# Altium schematic sheet 06-AD9546_TimestampInputs.SchDoc
size A; SheetNumber: 6; SheetTotal: 16
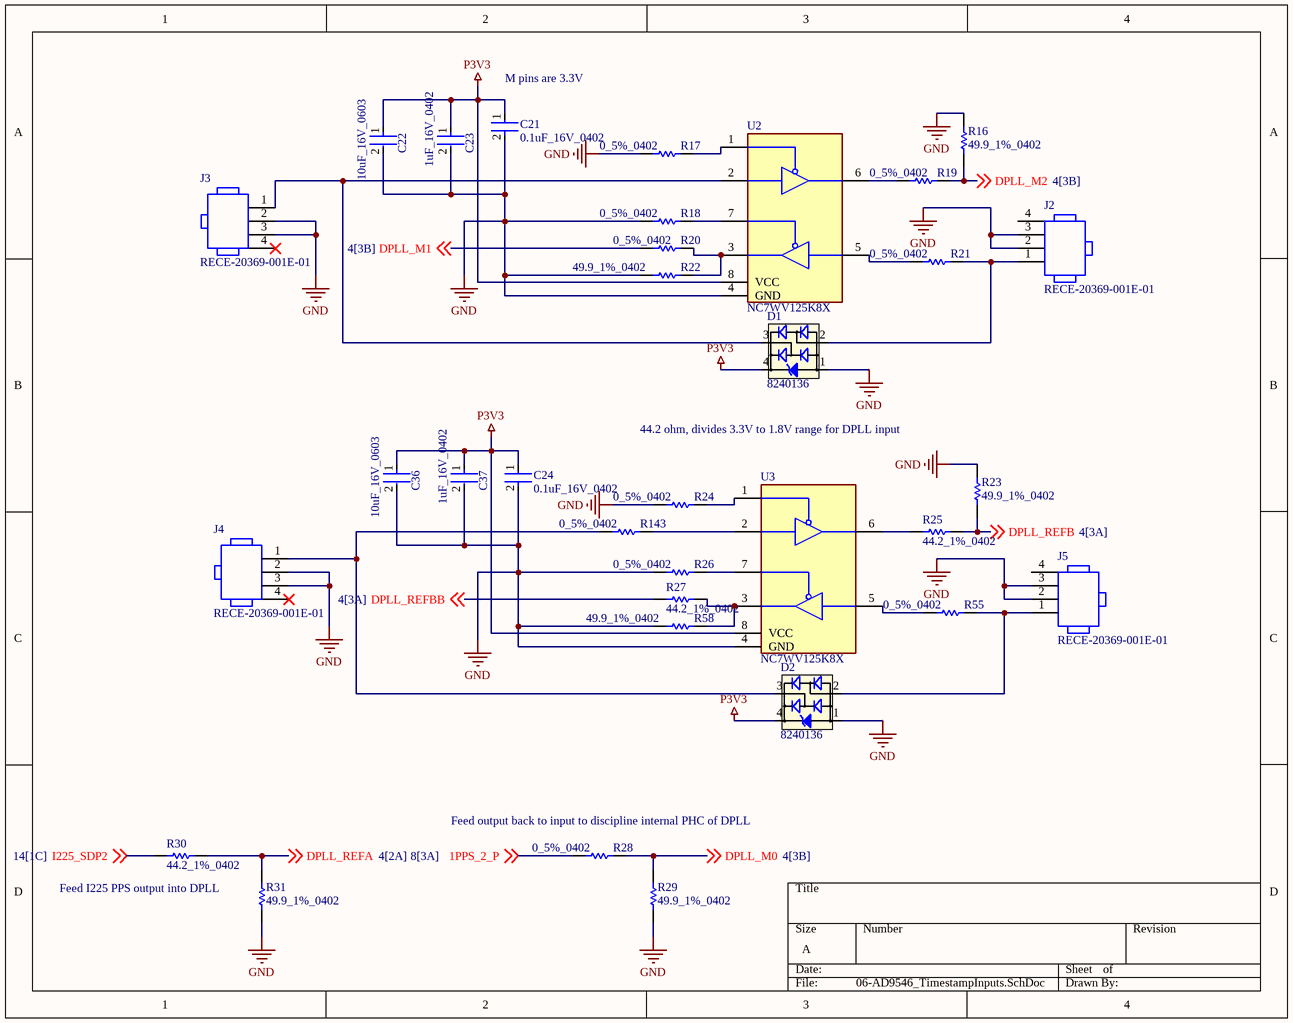
[diagram p0: 06-AD9546_TimestampInputs.SchDoc]

## Parts
C21  Digikey Description: 0.1uF_16V_0402  [FP-GRM15-MFG]  (hidden comment: GRM155R71C104KA88D)
C22  10uF_16V_0603  [FP-C1608-MFG]
C23  1uF_16V_0402  [FP-0402-L_1_0_0_05-W_0_5-IPC_C]
C24  Digikey Description: 0.1uF_16V_0402  [FP-GRM15-MFG]  (hidden comment: GRM155R71C104KA88D)
C36  10uF_16V_0603  [FP-C1608-MFG]
C37  1uF_16V_0402  [FP-0402-L_1_0_0_05-W_0_5-IPC_C]
D1  8240136  [SOT143-4L]
D2  8240136  [SOT143-4L]
J2  RECE-20369-001E-01  [TG-RECE-20369-001E-4_V]
J3  RECE-20369-001E-01  [TG-RECE-20369-001E-4_V]
J4  RECE-20369-001E-01  [TG-RECE-20369-001E-4_V]
J5  RECE-20369-001E-01  [TG-RECE-20369-001E-4_V]
R16  49.9_1%_0402  [RESC1005X40X25NL05T05]
R17  0_5%_0402  [RESC1005X40X25LL10T10]
R18  0_5%_0402  [RESC1005X40X25LL10T10]
R19  0_5%_0402  [RESC1005X40X25LL10T10]
R20  0_5%_0402  [RESC1005X40X25LL10T10]
R21  0_5%_0402  [RESC1005X40X25LL10T10]
R22  49.9_1%_0402  [RESC1005X40X25NL05T05]
R23  49.9_1%_0402  [RESC1005X40X25NL05T05]
R24  0_5%_0402  [RESC1005X40X25LL10T10]
R25  44.2_1%_0402  [RESC1005X40X25LL05T05]
R26  0_5%_0402  [RESC1005X40X25LL10T10]
R27  44.2_1%_0402  [RESC1005X40X25LL05T05]
R28  0_5%_0402  [RESC1005X40X25LL10T10]
R29  49.9_1%_0402  [RESC1005X40X25NL05T05]
R30  44.2_1%_0402  [RESC1005X40X25LL05T05]
R31  49.9_1%_0402  [RESC1005X40X25NL05T05]
R55  0_5%_0402  [RESC1005X40X25LL10T10]
R58  49.9_1%_0402  [RESC1005X40X25NL05T05]
R143  0_5%_0402  [RESC1005X40X25LL10T10]
U2  NC7WV125K8X  [NC7WV125]
U3  NC7WV125K8X  [NC7WV125]

## Nets
GND: C21.2 C22.2 C23.2 C24.2 C36.2 C37.2 D1.1(GND) D2.1(GND) J2.2 J2.3 J3.2 J3.3 J4.2 J4.3 J5.2 J5.3 R16.2 R17.1 R18.1 R22.2 R23.2 R24.1 R26.1 R29.1 R31.1 R58.2 U2.4(GND) U3.4(GND)
P3V3: C21.1 C22.1 C23.1 C24.1 C36.1 C37.1 D1.4(VDD) D2.4(VDD) U2.8(VCC) U3.8(VCC)
1PPS_2_P: R28.1 ; off-sheet 1PPS_2_P
DPLL_M0: R28.2 R29.2 ; off-sheet DPLL_M0
DPLL_M1: R20.1 ; off-sheet DPLL_M1
DPLL_M2: R16.1 R19.2 ; off-sheet DPLL_M2
DPLL_REFA: R30.2 R31.2 ; off-sheet DPLL_REFA
DPLL_REFB: R23.1 R25.2 ; off-sheet DPLL_REFB
DPLL_REFBB: R27.1 ; off-sheet DPLL_REFBB
I225_SDP2: R30.1 ; off-sheet I225_SDP2
NetD1_2: D1.2(I/O1) J2.1 R21.2
NetD1_3: D1.3(I/O2) J3.1 U2.2
NetD2_2: D2.2(I/O1) J5.1 R55.2
NetD2_3: D2.3(I/O2) J4.1 R143.1
NetR17_2: R17.2 U2.1
NetR18_2: R18.2 U2.7
NetR19_1: R19.1 U2.6
NetR20_2: R20.2 R22.1 U2.3
NetR21_1: R21.1 U2.5
NetR24_2: R24.2 U3.1
NetR25_1: R25.1 U3.6
NetR26_2: R26.2 U3.7
NetR27_2: R27.2 R58.1 U3.3
NetR55_1: R55.1 U3.5
NetR143_2: R143.2 U3.2

Not connected (* = marked no-connect by the designer): J2 4; J3 4*; J4 4*; J5 4

## Notes on the sheet
- (near C21) M pins are 3.3V
- 44.2 ohm, divides 3.3V to 1.8V range for DPLL input
- (near R28) Feed output back to input to discipline internal PHC of DPLL
- Feed I225 PPS output into DPLL

## Library data of the parts
C21 C24 = CMP-2100-03641-2: CAP CER 0.1UF 16V X7R 0402; Manufacturer: Murata; Standoff Height: 0mm; Tolerance: 10%; Voltage Rating: 16Vdc; Material: Ceramic; Capacitance: 0.10μF; Value: 0.10μF; RoHS: TRUE; Manufacturer Part Number: GRM155R71C104KA88D; Temperature Characteristic: X7R; Octopart: https://octopart.com/grm155r71c104ka88d-murata-196880; Device Class L3: Ceramic Capacitors; Height: 0.55mm; ComponentLink2Description: Datasheet; Temperature Range Low: -55°C; Ipc Land Pattern Name: CAPC10050X219; ComponentLink2URL: https://search.murata.co.jp/Ceramy/image/img/A01X/G101/ENG/GRM155R71H471KA01-01A.pdf; Device Class L1: Passive Components; Lead Free: yes; Category: Cap; Package: GRM15; Temperature: -55°C to +125°C; Device Class L2: Capacitors; Temperature Range High: +125°C; Mouser Description: 0402 0.1 uF 16V ±10 % Tolerance X7R SMT Multilayer Ceramic Capacitor
C22 C36 = CMP-08246-000019-1: CAP CER 10UF 16V X5R 0603; Manufacturer: TDK Corporation; Manufacturer Part Number: C1608X5R1C106M080AB; Temperature Coefficient: 15%; Tolerance: 20%; Material: Ceramic; Octopart: https://octopart.com/c1608x5r1c106m080ab-tdk-26013480; ComponentLink2Description: Datasheet; Value: 10uF; Temperature Range Low: -55°C; Digikey Description: CAP CER 10UF 16V X5R 0603; Package: C1608; Lead Free: Yes; Mouser Description: Multilayer Ceramic Capacitors MLCC - SMD/SMT 0603 10uF 16volts X5R +/-20% GP; Device Class L2: Capacitors; Voltage Rating: 16V; RoHS: TRUE; Automotive: No; Height: 0.9mm; Ipc Land Pattern Name: CAPC16080X80; ComponentLink2URL: https://upverter.com/datasheet/6fbac97fd59b4a24a005814037d2a36a27db40e9.pdf; Temperature Range High: +85°C; Capacitance: 10uF; Temperature: -55°C to +85°C; Category: Cap; Device Class L1: Passive Components; Device Class L3: Ceramic Capacitors; Temperature Characteristic: X5R
C23 C37 = CMP-14477-003537-2: None; Tolerance: 20%; Voltage Rating (DC): 16V; Capacitance: 1uF; Dielectric: X5R; Height: 0.5mm; Package Quantity: 10000; Series: M; Max Operating Temperature: 85°C; Width: 0.02inch; Mount: Surface Mount; Thickness: 0.022inch; Length: 1mm; Min Operating Temperature: -55°C; Depth: 0.5mm; RoHS Compliant: Yes; Construction: Flat; Case/Package: 0402; Radiation Hardening: No; Packaging: Tape and Reel; Voltage: 16V; Voltage Rating: 16V; Halogen Free: Halogen Free
D1 D2 = CMP-1486-00002-1: TVS Diode WE-TVS-HS, VRWM=3.3V; Manufacturer: Wuerth Elektronik; Reverse Stand Off Voltage: 3.3V; PartNumber: 8240136; ComponentLink1Description: Manufacturer URL; PackageReference: SOT143-4L; ComponentLink1URL: http://www.we-online.com; ComponentLink2Description: Datasheet; ComponentLink2URL: http://katalog.we-online.de/kataloge/eisos/media/pdf/8240136.pdf
J2-J5 = CMP-0275-00001-2: RF Connector, Onboard Receptacle, IPEX MHFIII; Manufacturer: Taoglas; Packing: Tape and Reel; Mounting Technology: Surface Mount; PackageReference: RECE-20369-001E-01-4; ComponentLink1URL: http://www.taoglas.com/; Housing Color: Gold; DatasheetVersion: Rev. C; ComponentLink2URL: http://www.taoglas.com/images/product_images/original_images/RECE.20369.001E.01.pdf; ComponentLink3Description: Package Specification; PackageVersion: Rev. C; ComponentLink1Description: Manufacturer URL; ComponentLink2Description: Datasheet; PackageDescription: 4-Pin, Hand Drawn, Body 1.7x1.7mm; ComponentLink3URL: http://www.taoglas.com/images/product_images/original_images/RECE.20369.001E.01.pdf; PartNumber: RECE-20369-001E-01
R16 R22 R23 R29 R31 R58 = CMP-2002-00969-1: Manufacturer: Panasonic; Part Number: ERJ-2RKF49R9X
R17-R21 R24 R26 R28 R55 R143 = CMP-2002-04569-1: Manufacturer: KOA Speer; Part Number: RK73Z1ETTP
R25 R27 R30 = CMP-2002-00011-1: Manufacturer: Vishay Dale; Part Number: CRCW040244R2FKED
U2 U3 = NC7WV125K8X: Integrated Circuit; Manufacturer_Name: ON Semiconductor; Datasheet Link: https://www.mouser.com/datasheet/2/308/NC7WV125-1301459.pdf; Height: 0.9mm; Manufacturer_Part_Number: NC7WV125K8X; Mouser Part Number: 512-NC7WV125K8X; Mouser Price/Stock: https://www.mouser.com/Search/Refine.aspx?Keyword=512-NC7WV125K8X; Arrow Part Number: NC7WV125K8X; Arrow Price/Stock: https://www.arrow.com/en/products/nc7wv125k8x/on-semiconductor